# Altium schematic sheet DCAR_Power.SchDoc: eBox_Power
size A4; DocumentNumber: 2; SheetNumber: 2; SheetTotal: 6
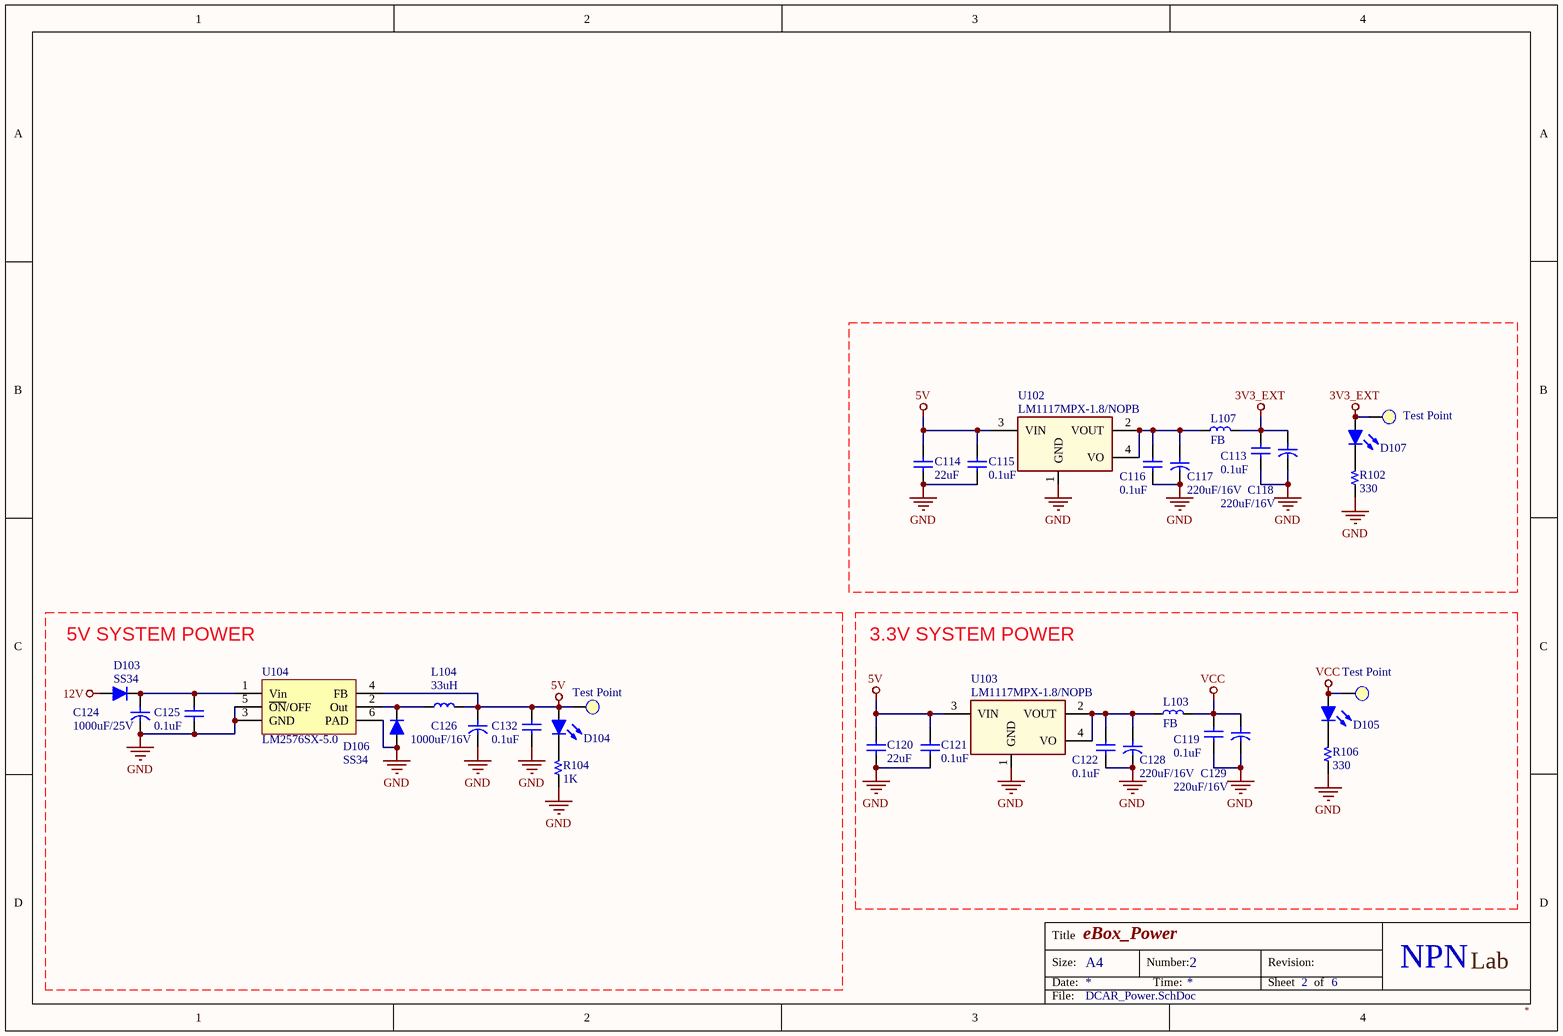
[diagram p0: DCAR_Power.SchDoc]

## Parts
3V3  Test Point  [TestPoint/SMD/1.5mm]  (no BOM)
5V  Test Point  [TestPoint/SMD/1.5mm]  (no BOM)
C113  0.1uF  [C 0805]
C114  22uF  [C 1210]
C115  0.1uF  [C 0805]
C116  0.1uF  [C 0805]
C117  220uF/16V  [CYL/D.250/LS.100]
C118  220uF/16V  [CYL/D.250/LS.100]
C119  0.1uF  [C 0805]
C120  22uF  [C 1210]
C121  0.1uF  [C 0805]
C122  0.1uF  [C 0805]
C124  1000uF/25V  [CAP/D100/H200/LS50]
C125  0.1uF  [C 0805]
C126  1000uF/16V  [CAP/D100/H200/LS50]
C128  220uF/16V  [CYL/D.250/LS.100]
C129  220uF/16V  [CYL/D.250/LS.100]
C132  0.1uF  [C 0805]
D103  SS34  [DO-214AC (SMA) L]
D104  5V Led  [LED 3MM - red]  (value not drawn)
D105  5V Led  [LED 3MM - red]  (value not drawn)
D106  SS34  [DO-214AC (SMA) L]
D107  5V Led  [LED 3MM - red]  (value not drawn)
L103  FB  [L 0805 (2012)]  (no BOM)
L104  33uH  [Inductor SMD 12x12x8]
L107  FB  [L 0805 (2012)]  (no BOM)
R102  330  [R 0603]
R104  1K  [R 0603]
R106  330  [R 0603]
U102  LM1117MPX-1.8/NOPB  [SOT-223]
U103  LM1117MPX-1.8/NOPB  [SOT-223]
U104  LM2576SX-5.0  [TO-263-6]
VCC  Test Point  [TestPoint/SMD/1.5mm]  (no BOM)

## Nets
3V3_EXT: 3V3.1(TP) C113.1 C118.1 D107.1(A) L107.2
5V: 5V.1(TP) C114.1 C115.1 C120.1 C121.1 C126.1 C132.1 D104.1(A) L104.2 U102.3(VIN) U103.3(VIN) U104.4(FB)
12V: D103.1(A)
GND: C113.2 C114.2 C115.2 C116.2 C117.2 C118.2 C119.2 C120.2 C121.2 C122.2 C124.2 C125.2 C126.2 C128.2 C129.2 C132.2 D106.1(A) R102.1 R104.1 R106.1 U102.1(GND) U103.1(GND) U104.3(GND) U104.5(~{ON}/OFF) U104.6(PAD)
VCC: C119.1 C129.1 D105.1(A) L103.2 VCC.1(TP)
NetC116_1: C116.1 C117.1 L107.1 U102.2(VOUT) U102.4(VO)
NetC122_1: C122.1 C128.1 L103.1 U103.2(VOUT) U103.4(VO)
NetC124_1: C124.1 C125.1 D103.2(K) U104.1(Vin)
NetD104_2: D104.2(K) R104.2
NetD105_2: D105.2(K) R106.2
NetD106_2: D106.2(K) L104.1 U104.2(Out)
NetD107_2: D107.2(K) R102.2

## Notes on the sheet
- 5V SYSTEM POWER
- 3.3V SYSTEM POWER
- Title
- Size:
- Date:
- A4
- Number:
- Time:
- Revision:
- Sheet
- of
- NPN
- Lab
- File:

## Library data of the parts
C113 C115 C116 C119 C121 C122 = Capacitor NP: CAP CER 0.1UF 50V X7R 0603; TYPE: SMD; PACKAGE: SMD0603; STOCK CODE: CC0603KRX7R9BB104; SUPPLIER: tme.vn; STOCK DESC: 100nF/50V ±10% X7R SMD-0603 Capacitor; UNIT PRICE: 400
C114 C120 = Capacitor NP: CAP CER 22UF 50V X7R 1210; TYPE: SMD; PACKAGE: SMD1210; STOCK CODE: CC1210KKX7R7BB226; SUPPLIER: tme.vn; STOCK DESC: 22uF/16V ±10% X7R SMD-1210 Capacitor; UNIT PRICE: 2500
C117 C118 C128 C129 = Capacitor: CAP TANT 100UF 20% 16V 2917; TYPE: SMD; PACKAGE: SMD7343; STOCK CODE: TAJD107M016RNJ; SUPPLIER: tme.vn; STOCK DESC: 100uF/16V ±20% SMD Tantalum Capacitor; UNIT PRICE: 9000
C124 C126 = Capacitor: Capacitor pol; BRAND: JWCO; TYPE: TH; PACKAGE: 10x17mm; STOCK CODE: 1000uF/25V; SUPPLIER: tme.vn; STOCK DESC: 1000uF/25V ±20% Aluminum Electrolytic Capacitor, Size 10x17mm; UNIT PRICE: 3000
C125 C132 = Capacitor NP: CAP CER 0.1UF 50V X7R 0805; TYPE: SMD; PACKAGE: SMD0603; STOCK CODE: CC0603KRX7R9BB104; SUPPLIER: tme.vn; STOCK DESC: 100nF/50V ±10% X7R SMD-0603 Capacitor; UNIT PRICE: 400
D103 D106 = Diode: Default Diode
D104 D105 D107 = Led: LED RED CLEAR 0603 SMD; TYPE: TH; PACKAGE: 3MM; STOCK CODE: HT204SURD; SUPPLIER: tme.vn; STOCK DESC: 3mm Base LED; UNIT PRICE: 300
L103 L107 = Inductor: TYPE: NO-BOM; UNIT PRICE: 0
L104 = Inductor
R102 R106 = Resistor: RES SMD 330 OHM 1% 1/10W 0603; PACKAGE: SMD0603; STOCK CODE: RM06JTN331; SUPPLIER: tme.vn; TYPE: SMD; STOCK DESC: 330R ±5% SMD-0603 Resistor; UNIT PRICE: 50
R104 = Resistor: RES SMD 1K OHM 1% 1/10W 0603; PACKAGE: SMD0603; STOCK CODE: RM06JTN102; SUPPLIER: tme.vn; TYPE: SMD; STOCK DESC: 1K ±5% SMD-0603 Resistor; UNIT PRICE: 50
U102 U103 = AMS1117: IC REG LINEAR 1.8V 800MA SOT223; BRAND: AMS; PACKAGE: SOT-223; STOCK CODE: AMS1117-1.8; SUPPLIER: tme.vn; TYPE: SMD; STOCK DESC: 1.8V 1A Low-dropout Linear Regulator; UNIT PRICE: 4000
U104 = LM2576SX-5.0: IC REG BUCK 5V 3A TO263-5; PART NO: LM2576SX-5.0/NOPB; BRAND: TI; PACKAGE: TO-263-6; STOCK CODE: LM2576SX-5.0/NOPBCT-ND; SUPPLIER: Digi-Key; TYPE: SMD
3V3 5V VCC = Test Point: TYPE: NO-BOM; UNIT PRICE: 0